# Altium schematic sheet NTC.SchDoc
size A4
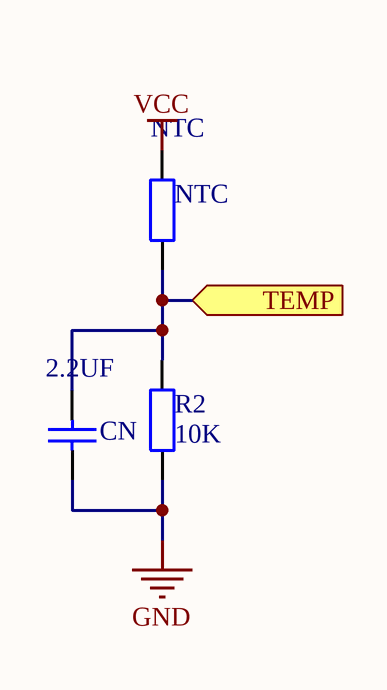
[diagram p0: NTC.SchDoc]

## Parts
CN  2.2UF  [C-0603]
NTC  NTC  [0603-2]
R2  10K  [0402]

## Ports
TEMP (in)

## Nets
GND: CN.1 R2.1
VCC: NTC.2
TEMP: CN.2 NTC.1 R2.2 ; port TEMP

## Library data of the parts
CN = CAP: Capacitor; Published: 8-Jun-2000; Revision: July-2002: Re-released for DXP Platform.; Publisher: Altium Limited; Value: 2.2uF
NTC = Res1: 贴片电阻; Value: 10K; Published: 8-Jun-2000; LatestRevisionDate: 17-Jul-2002; LatestRevisionNote: Re-released for DXP Platform.; PackageReference: AXIAL-0.4; Publisher: Altium Limited
R2 = Res1: 贴片电阻; Published: 8-Jun-2000; LatestRevisionDate: 17-Jul-2002; LatestRevisionNote: Re-released for DXP Platform.; PackageReference: AXIAL-0.4; Publisher: Altium Limited; Value: 10K